# Altium schematic sheet 01_MCU.SchDoc
size A4
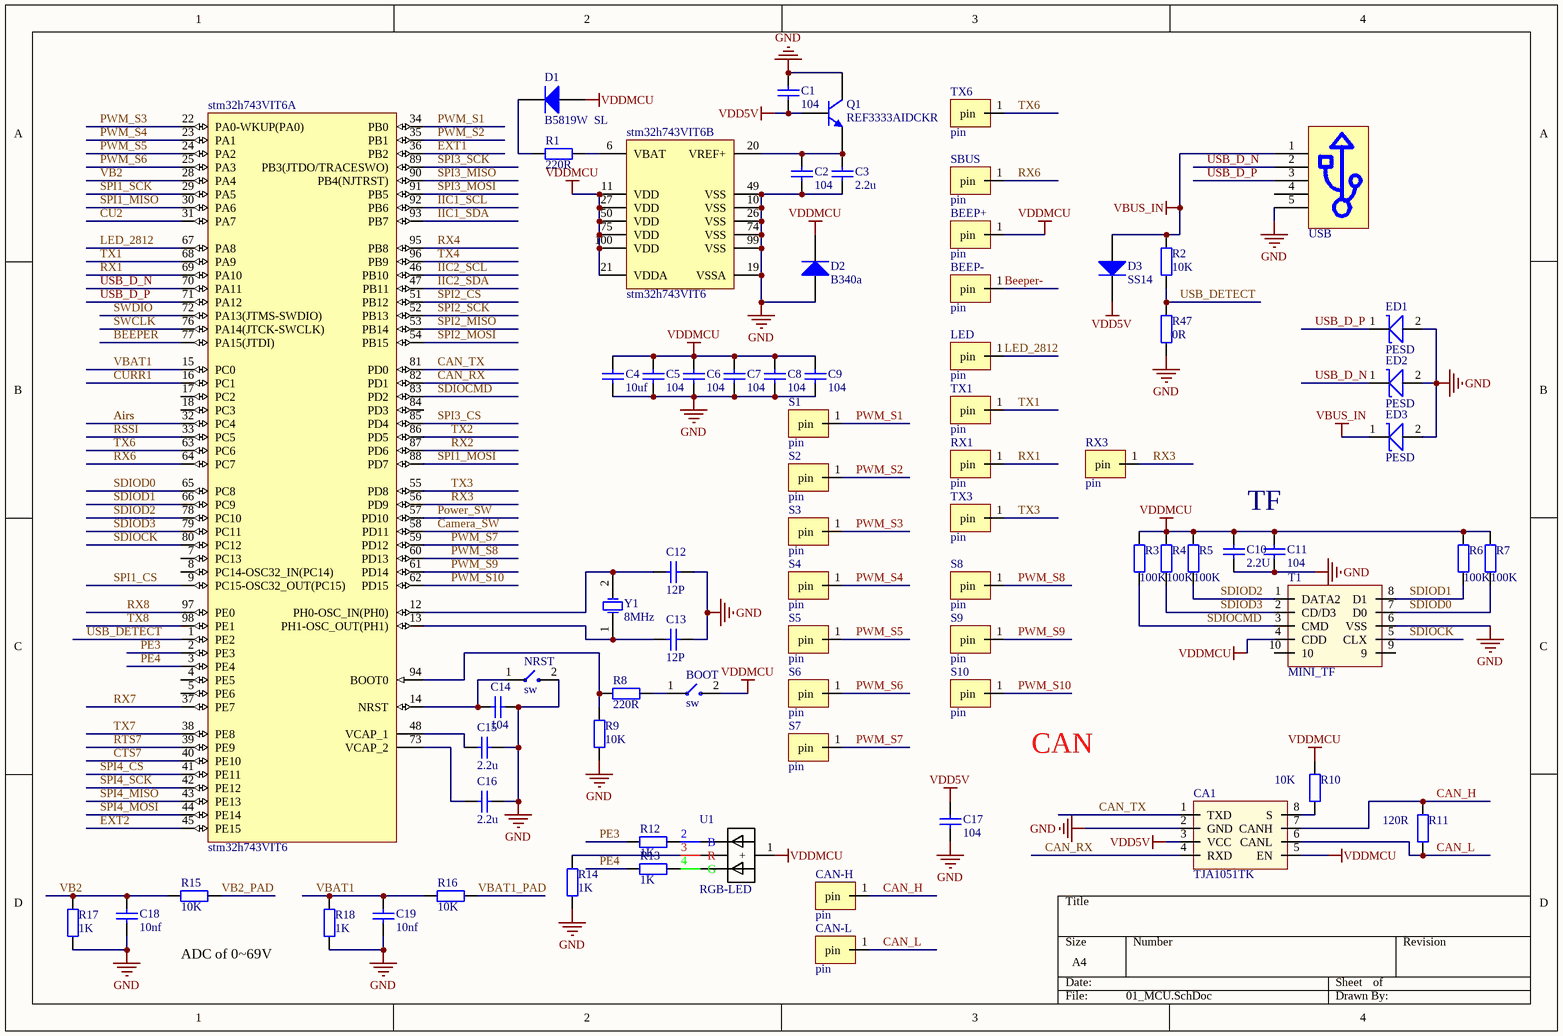
[diagram p0: 01_MCU.SchDoc]

## Parts
BEEP+  pin  [DIAN_0.5-1.0]
BEEP-  pin  [DIAN_0.5-1.0]
BOOT  sw  [SW_3*4mm]
C1  104  [0402_C]
C2  104  [0402_C]
C3  2.2u  [0603_C]
C4  10uf  [0603_C]
C5  104  [0402_C]
C6  104  [0402_C]
C7  104  [0402_C]
C8  104  [0402_C]
C9  104  [0402_C]
C10  2.2U  [0603_C]
C11  104  [0402_C]
C12  12P  [0402_C]
C13  12P  [0402_C]
C14  104  [0402_C]
C15  2.2u  [0603_C]
C16  2.2u  [0603_C]
C17  104  [0402_C]
C18  10nf  [0402_C]
C19  10nf  [0402_C]
CA1  TJA1051TK  [CAN-TJA1051TK]
CAN-H  pin  [DIAN_0.5-1.0]
CAN-L  pin  [DIAN_0.5-1.0]
D1  B5819W  SL  [SOD-123]
D2  B340a  [SMA(DO-214AC)_S1]
D3  SS14  [SMA(DO-214AC)_S1]
ED1  PESD  [PESD0402]
ED2  PESD  [PESD0402]
ED3  PESD  [PESD0402]
LED  pin  [DIAN_0.5-1.0]
NRST  sw  [SW_3*4mm]
Q1  REF3333AIDCKR  [SOT-23(SOT-23-3)]
R1  220R  [0402_R]
R2  10K  [0402_R]
R3  100K  [0402_R]
R4  100K  [0402_R]
R5  100K  [0402_R]
R6  100K  [0402_R]
R7  100K  [0402_R]
R8  220R  [0402_R]
R9  10K  [0402_R]
R10  10K  [0402_R]
R11  120R  [0402_R]
R12  1K  [0402_R]
R13  1K  [0402_R]
R14  1K  [0402_R]
R15  10K  [0402_R]
R16  10K  [0402_R]
R17  1K  [0402_R]
R18  1K  [0402_R]
R47  0R  [0402_R]
RX1  pin  [DIAN_0.5-1.0]
RX3  pin  [DIAN_0.5-1.0]
S1  pin  [DIAN_0.5-1.0]
S2  pin  [DIAN_0.5-1.0]
S3  pin  [DIAN_0.5-1.0]
S4  pin  [DIAN_0.5-1.0]
S5  pin  [DIAN_0.5-1.0]
S6  pin  [DIAN_0.5-1.0]
S7  pin  [DIAN_0.5-1.0]
S8  pin  [DIAN_0.5-1.0]
S9  pin  [DIAN_0.5-1.0]
S10  pin  [DIAN_0.5-1.0]
SBUS  pin  [DIAN_0.5-1.0]
stm32h743VIT6  stm32h743VIT6  [LQFP100-14x14mm]  (parts A,B of 2)
T1  MINI_TF  [mini_TF]
TX1  pin  [DIAN_0.5-1.0]
TX3  pin  [DIAN_0.5-1.0]
TX6  pin  [DIAN_0.5-1.0]
U1  RGB-LED  [RGB-3528]
USB  miniUSB  [USB-MINI-2]  (value not drawn)
Y1  8MHz  [SMD-5032_2P]

## Nets
GND: C1.1 C2.1 C3.1 C4.1 C5.2 C6.2 C7.2 C8.2 C9.2 C10.1 C11.1 C12.1 C13.1 C14.1 C15.1 C16.1 C17.2 C18.1 C19.1 CA1.2(GND) D2.1(A) ED1.2 ED2.2 ED3.2 NRST.2 Q1.3(C) R9.1 R14.2 R17.2 R18.2 R47.2 stm32h743VIT6.10(VSS) stm32h743VIT6.19(VSSA) stm32h743VIT6.26(VSS) stm32h743VIT6.49(VSS) stm32h743VIT6.74(VSS) stm32h743VIT6.99(VSS) T1.6(VSS) USB.5
VBUS_IN: D3.1(A) ED3.1 R2.2 USB.1
VDD5V: C1.2 C17.1 CA1.3(VCC) D3.2(K) Q1.1(B)
VDDMCU: BEEP+.1(pin) BOOT.2 C4.2 C5.1 C6.1 C7.1 C8.1 C9.1 C10.2 C11.2 CA1.5(EN) D1.1(A) D2.2(K) R3.2 R4.2 R5.2 R6.2 R7.2 R10.2 stm32h743VIT6.11(VDD) stm32h743VIT6.21(VDDA) stm32h743VIT6.27(VDD) stm32h743VIT6.50(VDD) stm32h743VIT6.75(VDD) stm32h743VIT6.100(VDD) T1.4(CDD) U1.1(+)
Airs: stm32h743VIT6.32(PC4)
BEEPER: stm32h743VIT6.77(PA15(JTDI))
Beeper-: BEEP-.1(pin)
Camera_SW: stm32h743VIT6.58(PD11)
CAN_H: CA1.7(CANH) CAN-H.1(pin) R11.2
CAN_L: CA1.6(CANL) CAN-L.1(pin) R11.1
CAN_RX: CA1.4(RXD) stm32h743VIT6.82(PD1)
CAN_TX: CA1.1(TXD) stm32h743VIT6.81(PD0)
CTS7: stm32h743VIT6.40(PE10)
CU2: stm32h743VIT6.31(PA7)
CURR1: stm32h743VIT6.16(PC1)
EXT1: stm32h743VIT6.36(PB2)
EXT2: stm32h743VIT6.45(PE15)
IIC1_SCL: stm32h743VIT6.92(PB6)
IIC1_SDA: stm32h743VIT6.93(PB7)
IIC2_SCL: stm32h743VIT6.46(PB10)
IIC2_SDA: stm32h743VIT6.47(PB11)
LED_2812: LED.1(pin) stm32h743VIT6.67(PA8)
PE3: R12.2 stm32h743VIT6.2(PE3)
PE4: R13.2 stm32h743VIT6.3(PE4)
Power_SW: stm32h743VIT6.57(PD10)
PWM_S1: S1.1(pin) stm32h743VIT6.34(PB0)
PWM_S2: S2.1(pin) stm32h743VIT6.35(PB1)
PWM_S3: S3.1(pin) stm32h743VIT6.22(PA0-WKUP(PA0))
PWM_S4: S4.1(pin) stm32h743VIT6.23(PA1)
PWM_S5: S5.1(pin) stm32h743VIT6.24(PA2)
PWM_S6: S6.1(pin) stm32h743VIT6.25(PA3)
PWM_S7: S7.1(pin) stm32h743VIT6.59(PD12)
PWM_S8: S8.1(pin) stm32h743VIT6.60(PD13)
PWM_S9: S9.1(pin) stm32h743VIT6.61(PD14)
PWM_S10: S10.1(pin) stm32h743VIT6.62(PD15)
RSSI: stm32h743VIT6.33(PC5)
RTS7: stm32h743VIT6.39(PE9)
RX1: RX1.1(pin) stm32h743VIT6.69(PA10)
RX2: stm32h743VIT6.87(PD6)
RX3: RX3.1(pin) stm32h743VIT6.56(PD9)
RX4: stm32h743VIT6.95(PB8)
RX6: SBUS.1(pin) stm32h743VIT6.64(PC7)
RX7: stm32h743VIT6.37(PE7)
RX8: stm32h743VIT6.97(PE0)
SDIOCK: stm32h743VIT6.80(PC12) T1.5(CLX)
SDIOCMD: R3.1 stm32h743VIT6.83(PD2) T1.3(CMD)
SDIOD0: R7.1 stm32h743VIT6.65(PC8) T1.7(D0)
SDIOD1: R6.1 stm32h743VIT6.66(PC9) T1.8(D1)
SDIOD2: R5.1 stm32h743VIT6.78(PC10) T1.1(DATA2)
SDIOD3: R4.1 stm32h743VIT6.79(PC11) T1.2(CD/D3)
SPI1_CS: stm32h743VIT6.9(PC15-OSC32_OUT(PC15))
SPI1_MISO: stm32h743VIT6.30(PA6)
SPI1_MOSI: stm32h743VIT6.88(PD7)
SPI1_SCK: stm32h743VIT6.29(PA5)
SPI2_CS: stm32h743VIT6.51(PB12)
SPI2_MISO: stm32h743VIT6.53(PB14)
SPI2_MOSI: stm32h743VIT6.54(PB15)
SPI2_SCK: stm32h743VIT6.52(PB13)
SPI3_CS: stm32h743VIT6.85(PD4)
SPI3_MISO: stm32h743VIT6.90(PB4(NJTRST))
SPI3_MOSI: stm32h743VIT6.91(PB5)
SPI3_SCK: stm32h743VIT6.89(PB3(JTDO/TRACESWO))
SPI4_CS: stm32h743VIT6.41(PE11)
SPI4_MISO: stm32h743VIT6.43(PE13)
SPI4_MOSI: stm32h743VIT6.44(PE14)
SPI4_SCK: stm32h743VIT6.42(PE12)
SWCLK: stm32h743VIT6.76(PA14(JTCK-SWCLK))
SWDIO: stm32h743VIT6.72(PA13(JTMS-SWDIO))
TX1: stm32h743VIT6.68(PA9) TX1.1(pin)
TX2: stm32h743VIT6.86(PD5)
TX3: stm32h743VIT6.55(PD8) TX3.1(pin)
TX4: stm32h743VIT6.96(PB9)
TX6: stm32h743VIT6.63(PC6) TX6.1(pin)
TX7: stm32h743VIT6.38(PE8)
TX8: stm32h743VIT6.98(PE1)
USB_D_N: ED2.1 stm32h743VIT6.70(PA11) USB.2
USB_D_P: ED1.1 stm32h743VIT6.71(PA12) USB.3
USB_DETECT: R2.1 R47.1 stm32h743VIT6.1(PE2)
VB2: C18.2 R15.1 R17.1 stm32h743VIT6.28(PA4)
VB2_PAD: R15.2
VBAT1: C19.2 R16.1 R18.1 stm32h743VIT6.15(PC0)
VBAT1_PAD: R16.2
NetBOOT_1: BOOT.1 R8.1
NetC2_2: C2.2 C3.2 Q1.2(E) stm32h743VIT6.20(VREF+)
NetC12_2: C12.2 stm32h743VIT6.12(PH0-OSC_IN(PH0)) Y1.2(OSC2)
NetC13_2: C13.2 stm32h743VIT6.13(PH1-OSC_OUT(PH1)) Y1.1(OSC1)
NetC14_2: C14.2 NRST.1 stm32h743VIT6.14(NRST)
NetC15_2: C15.2 stm32h743VIT6.48(VCAP_1)
NetC16_2: C16.2 stm32h743VIT6.73(VCAP_2)
NetCA1_8: CA1.8(S) R10.1
NetD1_2: D1.2(K) R1.2
NetR1_1: R1.1 stm32h743VIT6.6(VBAT)
NetR8_2: R8.2 R9.2 stm32h743VIT6.94(BOOT0)
NetR12_1: R12.1 U1.2(B)
NetR13_1: R13.1 U1.4(G)
NetR14_1: R14.1 U1.3(R)

Not connected (* = marked no-connect by the designer): stm32h743VIT6 4(PE5) 5(PE6) 7(PC13) 8(PC14-OSC32_IN(PC14)) 17(PC2) 18(PC3) 84(PD3); T1 9 10; USB 4

## Notes on the sheet
- TF
- CAN
- ADC of 0~69V

## Library data of the parts
BEEP+ BEEP- CAN-H CAN-L LED RX1 RX3 S1-S10 SBUS TX1 TX3 TX6 = dian
BOOT NRST = SW3*4mm
C1 C2 C5-C9 C11-C14 C17-C19 = 0402 100nF (104) 10% 16V: 贴片电容; ComponentLink1Description: 供应商链接; ComponentLink1URL: http://www.szlcsc.com/product/details_1877.html; Package: 0402; Supplier: LC; SuppliersPartNumber: C1525
C3 C4 C15 C16 = 0603 10nF (103) 10% 50V: 贴片电容; ComponentLink1Description: 供应商链接; ComponentLink1URL: http://www.szlcsc.com/product/details_58143.html; Package: 0603; Supplier: LC; SuppliersPartNumber: C57112
C10 = 0603 100nF (104) 10% 50V: 贴片电容; ComponentLink1Description: 供应商链接; ComponentLink1URL: http://www.szlcsc.com/product/details_15331.html; Package: 0603; Supplier: LC; SuppliersPartNumber: C14663
CA1 = TJA1051TK: CAN收发器
D1 = SOD-123 B5819W  SL: 肖特基二极管; ComponentLink1Description: 供应商链接; ComponentLink1URL: http://www.szlcsc.com/product/details_9093.html; Package: SOD-123; Supplier: LC; SuppliersPartNumber: C8598
D2 = SMA(DO-214AC) M7: 二极管; 备注: 1N4007 4007 编号C2464 已经停售, 使用新物料编号C95872; ComponentLink1Description: 供应商链接; ComponentLink1URL: http://www.szlcsc.com/product/details_2841.html; Package: SMA(DO-214AC); Supplier: LC; SuppliersPartNumber: C95872
D3 = SMA(DO-214AC) SS54: 二极管; ComponentLink1Description: 供应商链接; ComponentLink1URL: http://www.szlcsc.com/product/details_23178.html; Package: SMA(DO-214AC); Supplier: LC; SuppliersPartNumber: C22452
ED1-ED3 = PESD0402: ESD
Q1 = SOT-23 SS8050 Y1: 三极管; ComponentLink1Description: 供应商链接; ComponentLink1URL: http://www.szlcsc.com/product/details_2507.html; Package: SOT-23; Supplier: LC; SuppliersPartNumber: C2150
R1-R18 = 0402 100Ω (1000) 1%: 贴片电阻; ComponentLink1Description: 供应商链接; ComponentLink1URL: http://www.szlcsc.com/product/details_25819.html; Package: 0402; Supplier: LC; SuppliersPartNumber: C25076
R47 = 0402 10KΩ (1002) 1%: 贴片电阻; ComponentLink1Description: 供应商链接; ComponentLink1URL: http://www.szlcsc.com/product/details_26487.html; Package: 0402; Supplier: LC; SuppliersPartNumber: C25744
T1 = MINI_TF: TF-card
Y1 = SMD-5032_2P 8MHz 20ppm 20pF: 贴片晶振; ComponentLink1Description: 供应商链接; ComponentLink1URL: http://www.szlcsc.com/product/details_117214.html; Package: SMD-5032_2P; Supplier: LC; SuppliersPartNumber: C115962